# Altium project Lion-IRVT.PrjPcb (part 4 of 8)
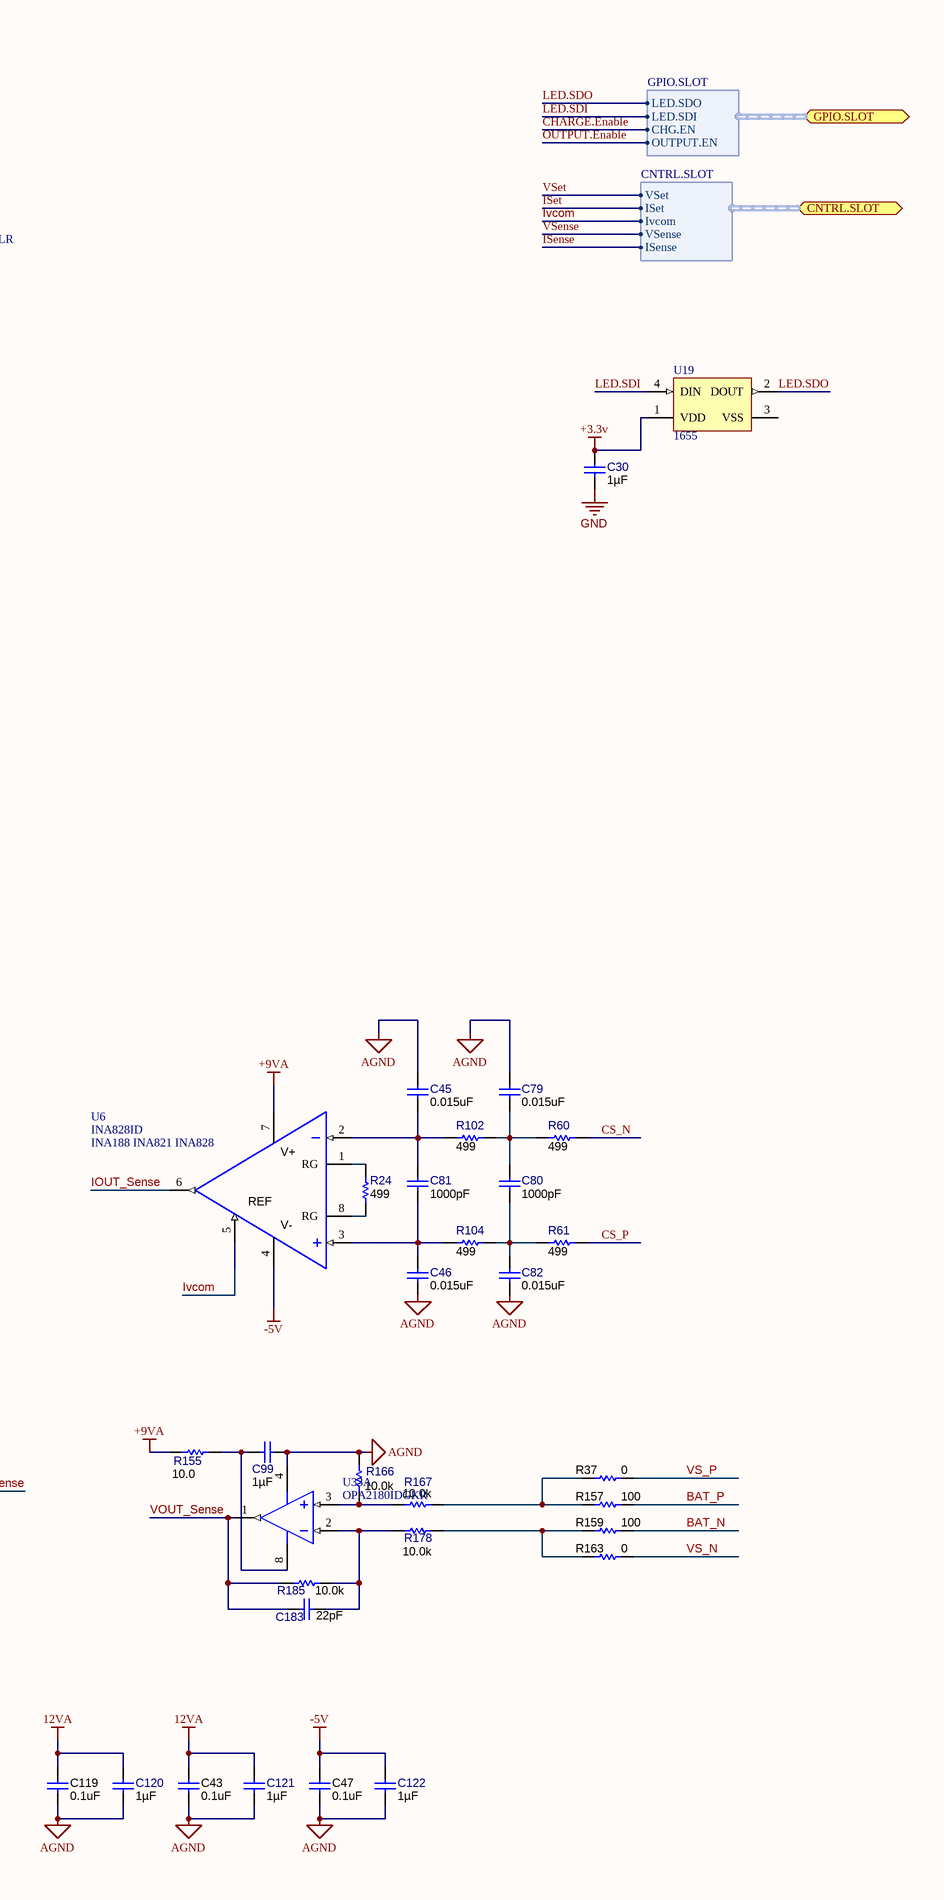
[diagram p104: LionIRVT-PMP40182.Control.SchDoc, right]

## Sheet LionIRVT-PMP40182.Control.SchDoc (continued)

### Library data of the parts (continued)
U32 = CMP-0069-01835-4: High-Side Protection Controller with Low Quiescent Current, 10-pin MSOP, Pb-Free; Manufacturer: Texas Instruments; PackageTopMarking: ZXTT*SZAB; CompType: Switcher; High-Reliability: Y; PackageDescription: Mini-SO, Molded, .118 x .118 x .034in Body, 10 Lead, .0197in Pitch; PartNumber: LM5060Q1MM/NOPB; ComponentLink1URL: http://www.ti.com/general/docs/lit/getliterature.tsp?genericPartNumber=LM5060-Q1&fileType=pdf; Code_JEDEC: MO-187-BA; PackageReference: DGS0010A; PinCount: 10; RoHS: Y; PowerWise: Y; ComponentLink1Description: Datasheet URL
U37 = CMP-0326-00053-3: Low-Capacitance Array with + / - 15 kV ESD Protection, 4 Channels, -40 to +85 degC, 5-pin SOT (DRL), Green (RoHS & no Sb/Br); Manufacturer: Texas Instruments; IEC 61000-4-2 Contact(+/- kV): 15; Breakdown Voltage(Min)(V): 6; IO Capacitance(Typ)(pF): 11; SubFamily: ESD Solution; IO Leakage Current(nA): 100; ComponentLink3Description: URL Link1; ComponentLink3URL: SamplesURL:http://www.ti.com/product/tpd4e002#samples; PackageReference: DRL0005A; ComponentLink2Description: Datasheet; DatasheetVersion: SLVS615D; PackageVersion: revD, Aug-2007; ComponentLink1URL: http://www.ti.com/; ComponentLink1Description: Manufacturer URL; PackageDescription: 5-Pin Plastic Small Outline, Flat Lead 0.5 mm Pitch; Mounting Technology: Surface Mount; Eco-Plan: Green (RoHS & no Sb/Br); IEC 61000-4-2 Air-Gap(+/- kV): 15; PartNumber: TPD4E002DRLR; ComponentLink2URL: http://www.ti.com/general/docs/lit/getliterature.tsp?genericPartNumber=TPD4E002&fileType=pdf